# Altium schematic sheet Sheet2.SchDoc
size A4; SheetNumber: 2; SheetTotal: 2
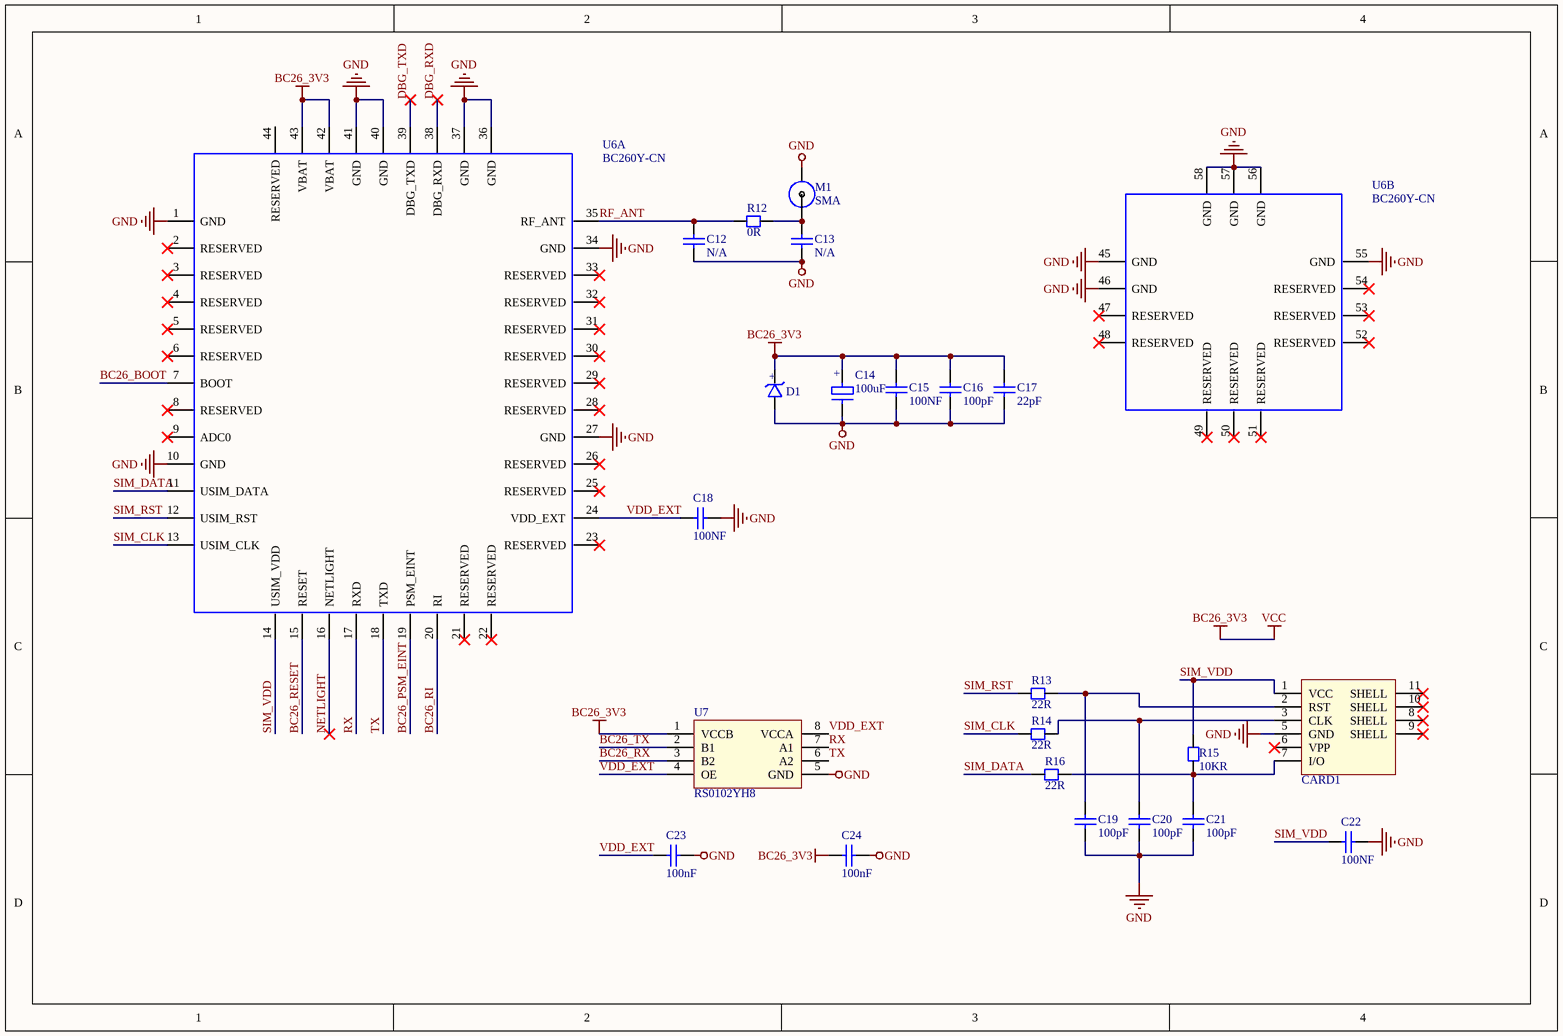
[diagram p0: Sheet2.SchDoc]

## Parts
C12  N/A  [CC1608-0603]
C13  N/A  [CC1608-0603]
C14  100uF  [CASE-B_3528]
C15  100NF  [CC1608-0603]
C16  100pF  [CC1608-0603]
C17  22pF  [CC1608-0603]
C18  100NF  [CC1608-0603]
C19  100pF  [CC1608-0603]
C20  100pF  [CC1608-0603]
C21  100pF  [CC1608-0603]
C22  100NF  [CC1608-0603]
C23  100nF  [CC1608-0603]
C24  100nF  [CC1608-0603]
CARD1  SIM-6P  [SIM-P6]  (value not drawn)
D1  SMBJ3.3A  [DO214AA(SMB)]  (value not drawn)
M1  SMA  [SMA-KWE]
R12  0R  [CR1608-0603]
R13  22R  [CR1608-0603]
R14  22R  [CR1608-0603]
R15  10KR  [CR1608-0603]
R16  22R  [CR1608-0603]
U6  BC260Y-CN  [BC260Y-CN]  (parts A,B of 2)
U7  RS0102YH8  [SOT-23-8]

## Nets
BC26_3V3: C14.1(+) C15.2 C16.2 C17.2 C24.1 D1.1 U6.42(VBAT) U6.43(VBAT) U7.1(VCCB)  [also labelled VCC]
GND: C12.2 C13.1 C14.2(-) C15.1 C16.1 C17.1 C18.1 C19.1 C20.1 C21.1 C22.1 C23.2 C24.2 CARD1.5(GND) D1.2 M1.2(GND) U6.1(GND) U6.10(GND) U6.27(GND) U6.34(GND) U6.36(GND) U6.37(GND) U6.40(GND) U6.41(GND) U6.45(GND) U6.46(GND) U6.55(GND) U6.56(GND) U6.57(GND) U6.58(GND) U7.5(GND)
BC26_BOOT: U6.7(BOOT)
BC26_PSM_EINT: U6.19(PSM_EINT)
BC26_RESET: U6.15(RESET)
BC26_RI: U6.20(RI)
BC26_RX: U7.3(B2)
BC26_TX: U7.2(B1)
DBG_RXD: U6.38(DBG_RXD)
DBG_TXD: U6.39(DBG_TXD)
NETLIGHT: U6.16(NETLIGHT)
RF_ANT: C12.1 R12.2 U6.35(RF_ANT)
RX: U6.17(RXD) U7.7(A1)
SIM_CLK: R14.1 U6.13(USIM_CLK)
SIM_DATA: R16.1 U6.11(USIM_DATA)
SIM_RST: R13.1 U6.12(USIM_RST)
SIM_VDD: C22.2 CARD1.1(VCC) R15.1 U6.14(USIM_VDD)
TX: U6.18(TXD) U7.6(A2)
VDD_EXT: C18.2 C23.1 U6.24(VDD_EXT) U7.4(OE) U7.8(VCCA)
NetC13_2: C13.2 M1.1(M) R12.1
NetC19_2: C19.2 CARD1.2(RST) R13.2
NetC20_2: C20.2 CARD1.3(CLK) R14.2
NetC21_2: C21.2 CARD1.7(I/O) R15.2 R16.2

Not connected (* = marked no-connect by the designer): CARD1 6(VPP)* 8(SHELL)* 9(SHELL)* 10(SHELL)* 11(SHELL)*; U6 2(RESERVED)* 3(RESERVED)* 4(RESERVED)* 5(RESERVED)* 6(RESERVED)* 8(RESERVED)* 9(ADC0)* 21(RESERVED)* 22(RESERVED)* 23(RESERVED)* 25(RESERVED)* 26(RESERVED)* 28(RESERVED)* 29(RESERVED)* 30(RESERVED)* 31(RESERVED)* 32(RESERVED)* 33(RESERVED)* 44(RESERVED) 47(RESERVED)* 48(RESERVED)* 49(RESERVED)* 50(RESERVED)* 51(RESERVED)* 52(RESERVED)* 53(RESERVED)* 54(RESERVED)*

## Notes on the sheet
- (in symbol SMBJ3.3A) +

## Library data of the parts
C12 C13 C15-C24 = Chip capacitor: 贴片电容
C14 = Chip capacitor TAJB107K006RNJ: 钽电容 3528封装
CARD1 = SIM-6P: sim卡座，自弹出样式，可以插入小卡
D1 = SMBJ3.3A: 3.3V稳压管，缓解瞬间电压冲击
M1 = SMA: 天线
R12-R16 = Chip resistor: 贴片电阻
U6 = BC260Y-CN: Part Description: BC260Y-CN 17.7×15.8mm H2.2mm RO; Manufacturer: QUECTEL; Geometry.Height: 2.2mm; Value: BC260Y-CN; BOMRemark: *; option: *; Part Number: *; PCB DECAL: BC260Y-CN
U7 = RS0102: 电平转换芯片